# Altium schematic sheet 07_FPGA_C.SchDoc: FPGA Part C: Bank 5-6
size 381 x 266 mm; Organization: Meteroi; Address1: Room 428, 410 Guiping Rd.; Address2: Shanghai 200233, CHINA; SheetNumber: 8; SheetTotal: 11; PageSetup: Record=PageOptions|CenterHorizontal=True|CenterVertical=True|PrintScale=0.75|XCorrection=1.00|YCorrection=1.00|PrintKind=2|BorderSize=5000000|LeftOffset=0|BottomOffset=0|Orientation=2|PaperLength=1000|PaperWidth=1000|Scale=100|PaperSource=276|PrintQuality=-3|MediaType=1|DitherType=10|PaperKind=A4|PrintScaleMode=1
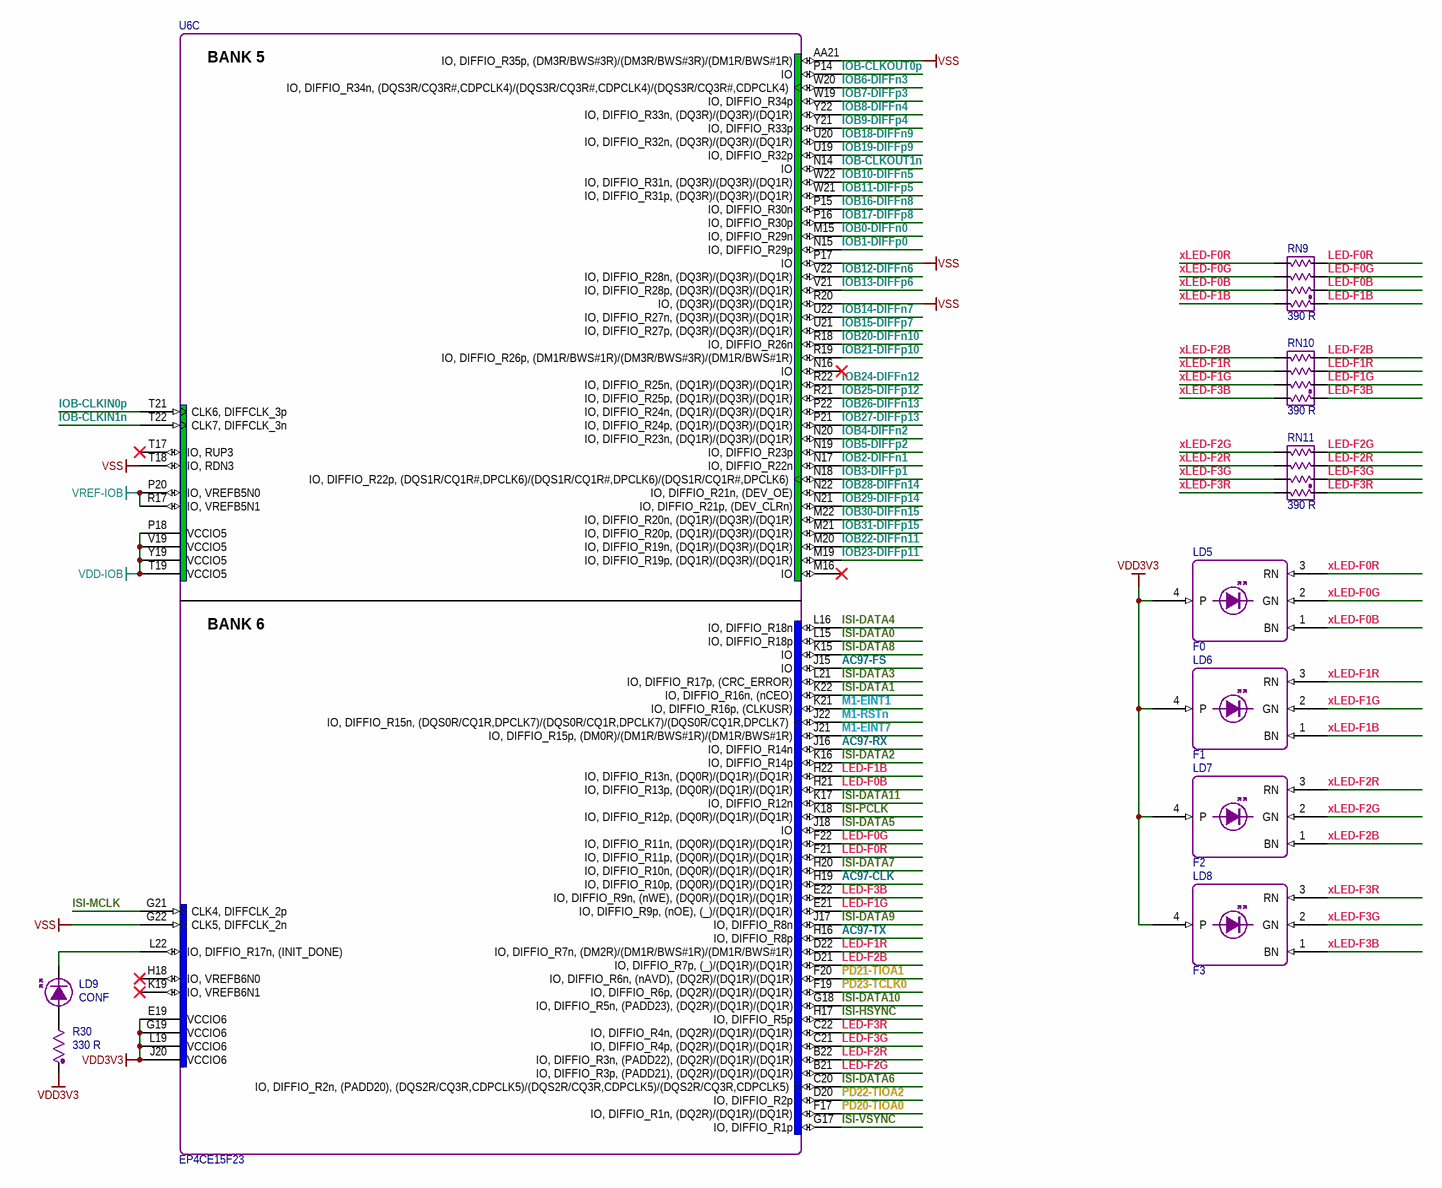
[diagram p0: 07_FPGA_C.SchDoc]

## Parts
LD5  F0  [LED_4B_S_S197]
LD6  F1  [LED_4B_S_S197]
LD7  F2  [LED_4B_S_S197]
LD8  F3  [LED_4B_S_S197]
LD9  CONF  [0603LD]
R30  330 R  [0402A2]
RN9  390 R  [0402PR4]
RN10  390 R  [0402PR4]
RN11  390 R  [0402PR4]
U6  EP4CE15F23  [FBGA-484]  (part C of 5)

## Nets
VDD3V3: LD5.4(P) LD6.4(P) LD7.4(P) LD8.4(P) R30.2 U6.E19(VCCIO6) U6.G19(VCCIO6) U6.J20(VCCIO6) U6.L19(VCCIO6)
VDD-IOB: U6.P18(VCCIO5) U6.T19(VCCIO5) U6.V19(VCCIO5) U6.Y19(VCCIO5)
VREF-IOB: U6.P20(IO,_VREFB5N0) U6.R17(IO,_VREFB5N1)
VSS: U6.AA21(IO,_DIFFIO_R35p,_(DM3R/BWS#3R)/(DM3R/BWS#3R)/(DM1R/BWS#1R)) U6.G22(CLK5,_DIFFCLK_2n) U6.P17(IO) U6.R20(IO,_(DQ3R)/(DQ3R)/(DQ1R)) U6.T18(IO,_RDN3)
AC97-CLK: U6.H19(IO,_DIFFIO_R10p,_(DQ0R)/(DQ1R)/(DQ1R))
AC97-FS: U6.J15(IO)
AC97-RX: U6.J16(IO,_DIFFIO_R14n)
AC97-TX: U6.H16(IO,_DIFFIO_R8p)
IOB0-DIFFn0: U6.M15(IO,_DIFFIO_R29n)
IOB1-DIFFp0: U6.N15(IO,_DIFFIO_R29p)
IOB2-DIFFn1: U6.N17(IO,_DIFFIO_R22n)
IOB3-DIFFp1: U6.N18(IO,_DIFFIO_R22p,_(DQS1R/CQ1R#,DPCLK6)/(DQS1R/CQ1R#,DPCLK6)/(DQS1R/CQ1R#,DPCLK6))
IOB4-DIFFn2: U6.N20(IO,_DIFFIO_R23n,_(DQ1R)/(DQ3R)/(DQ1R))
IOB5-DIFFp2: U6.N19(IO,_DIFFIO_R23p)
IOB6-DIFFn3: U6.W20(IO,_DIFFIO_R34n,_(DQS3R/CQ3R#,CDPCLK4)/(DQS3R/CQ3R#,CDPCLK4)/(DQS3R/CQ3R#,CDPCLK4))
IOB7-DIFFp3: U6.W19(IO,_DIFFIO_R34p)
IOB8-DIFFn4: U6.Y22(IO,_DIFFIO_R33n,_(DQ3R)/(DQ3R)/(DQ1R))
IOB9-DIFFp4: U6.Y21(IO,_DIFFIO_R33p)
IOB10-DIFFn5: U6.W22(IO,_DIFFIO_R31n,_(DQ3R)/(DQ3R)/(DQ1R))
IOB11-DIFFp5: U6.W21(IO,_DIFFIO_R31p,_(DQ3R)/(DQ3R)/(DQ1R))
IOB12-DIFFn6: U6.V22(IO,_DIFFIO_R28n,_(DQ3R)/(DQ3R)/(DQ1R))
IOB13-DIFFp6: U6.V21(IO,_DIFFIO_R28p,_(DQ3R)/(DQ3R)/(DQ1R))
IOB14-DIFFn7: U6.U22(IO,_DIFFIO_R27n,_(DQ3R)/(DQ3R)/(DQ1R))
IOB15-DIFFp7: U6.U21(IO,_DIFFIO_R27p,_(DQ3R)/(DQ3R)/(DQ1R))
IOB16-DIFFn8: U6.P15(IO,_DIFFIO_R30n)
IOB17-DIFFp8: U6.P16(IO,_DIFFIO_R30p)
IOB18-DIFFn9: U6.U20(IO,_DIFFIO_R32n,_(DQ3R)/(DQ3R)/(DQ1R))
IOB19-DIFFp9: U6.U19(IO,_DIFFIO_R32p)
IOB20-DIFFn10: U6.R18(IO,_DIFFIO_R26n)
IOB21-DIFFp10: U6.R19(IO,_DIFFIO_R26p,_(DM1R/BWS#1R)/(DM3R/BWS#3R)/(DM1R/BWS#1R))
IOB22-DIFFn11: U6.M20(IO,_DIFFIO_R19n,_(DQ1R)/(DQ3R)/(DQ1R))
IOB23-DIFFp11: U6.M19(IO,_DIFFIO_R19p,_(DQ1R)/(DQ3R)/(DQ1R))
IOB24-DIFFn12: U6.R22(IO,_DIFFIO_R25n,_(DQ1R)/(DQ3R)/(DQ1R))
IOB25-DIFFp12: U6.R21(IO,_DIFFIO_R25p,_(DQ1R)/(DQ3R)/(DQ1R))
IOB26-DIFFn13: U6.P22(IO,_DIFFIO_R24n,_(DQ1R)/(DQ3R)/(DQ1R))
IOB27-DIFFp13: U6.P21(IO,_DIFFIO_R24p,_(DQ1R)/(DQ3R)/(DQ1R))
IOB28-DIFFn14: U6.N22(IO,_DIFFIO_R21n,_(DEV_OE))
IOB29-DIFFp14: U6.N21(IO,_DIFFIO_R21p,_(DEV_CLRn))
IOB30-DIFFn15: U6.M22(IO,_DIFFIO_R20n,_(DQ1R)/(DQ3R)/(DQ1R))
IOB31-DIFFp15: U6.M21(IO,_DIFFIO_R20p,_(DQ1R)/(DQ3R)/(DQ1R))
IOB-CLKIN0p: U6.T21(CLK6,_DIFFCLK_3p)
IOB-CLKIN1n: U6.T22(CLK7,_DIFFCLK_3n)
IOB-CLKOUT0p: U6.P14(IO)
IOB-CLKOUT1n: U6.N14(IO)
ISI-DATA0: U6.L15(IO,_DIFFIO_R18p)
ISI-DATA1: U6.K22(IO,_DIFFIO_R16n,_(nCEO))
ISI-DATA2: U6.K16(IO,_DIFFIO_R14p)
ISI-DATA3: U6.L21(IO,_DIFFIO_R17p,_(CRC_ERROR))
ISI-DATA4: U6.L16(IO,_DIFFIO_R18n)
ISI-DATA5: U6.J18(IO)
ISI-DATA6: U6.C20(IO,_DIFFIO_R2n,_(PADD20),_(DQS2R/CQ3R,CDPCLK5)/(DQS2R/CQ3R,CDPCLK5)/(DQS2R/CQ3R,CDPCLK5))
ISI-DATA7: U6.H20(IO,_DIFFIO_R10n,_(DQ0R)/(DQ1R)/(DQ1R))
ISI-DATA8: U6.K15(IO)
ISI-DATA9: U6.J17(IO,_DIFFIO_R8n)
ISI-DATA10: U6.G18(IO,_DIFFIO_R5n,_(PADD23),_(DQ2R)/(DQ1R)/(DQ1R))
ISI-DATA11: U6.K17(IO,_DIFFIO_R12n)
ISI-HSYNC: U6.H17(IO,_DIFFIO_R5p)
ISI-MCLK: U6.G21(CLK4,_DIFFCLK_2p)
ISI-PCLK: U6.K18(IO,_DIFFIO_R12p,_(DQ0R)/(DQ1R)/(DQ1R))
ISI-VSYNC: U6.G17(IO,_DIFFIO_R1p)
LED-F0B: RN9.3 U6.H21(IO,_DIFFIO_R13p,_(DQ0R)/(DQ1R)/(DQ1R))
LED-F0G: RN9.5 U6.F22(IO,_DIFFIO_R11n,_(DQ0R)/(DQ1R)/(DQ1R))
LED-F0R: RN9.7 U6.F21(IO,_DIFFIO_R11p,_(DQ0R)/(DQ1R)/(DQ1R))
LED-F1B: RN9.1 U6.H22(IO,_DIFFIO_R13n,_(DQ0R)/(DQ1R)/(DQ1R))
LED-F1G: RN10.3 U6.E21(IO,_DIFFIO_R9p,_(nOE),_(_)/(DQ1R)/(DQ1R))
LED-F1R: RN10.5 U6.D22(IO,_DIFFIO_R7n,_(DM2R)/(DM1R/BWS#1R)/(DM1R/BWS#1R))
LED-F2B: RN10.7 U6.D21(IO,_DIFFIO_R7p,_(_)/(DQ1R)/(DQ1R))
LED-F2G: RN11.7 U6.B21(IO,_DIFFIO_R3p,_(PADD21),_(DQ2R)/(DQ1R)/(DQ1R))
LED-F2R: RN11.5 U6.B22(IO,_DIFFIO_R3n,_(PADD22),_(DQ2R)/(DQ1R)/(DQ1R))
LED-F3B: RN10.1 U6.E22(IO,_DIFFIO_R9n,_(nWE),_(DQ0R)/(DQ1R)/(DQ1R))
LED-F3G: RN11.3 U6.C21(IO,_DIFFIO_R4p,_(DQ2R)/(DQ1R)/(DQ1R))
LED-F3R: RN11.1 U6.C22(IO,_DIFFIO_R4n,_(DQ2R)/(DQ1R)/(DQ1R))
M1-EINT1: U6.K21(IO,_DIFFIO_R16p,_(CLKUSR))
M1-EINT7: U6.J21(IO,_DIFFIO_R15p,_(DM0R)/(DM1R/BWS#1R)/(DM1R/BWS#1R))
M1-RSTn: U6.J22(IO,_DIFFIO_R15n,_(DQS0R/CQ1R,DPCLK7)/(DQS0R/CQ1R,DPCLK7)/(DQS0R/CQ1R,DPCLK7))
PD20-TIOA0: U6.F17(IO,_DIFFIO_R1n,_(DQ2R)/(DQ1R)/(DQ1R))
PD21-TIOA1: U6.F20(IO,_DIFFIO_R6n,_(nAVD),_(DQ2R)/(DQ1R)/(DQ1R))
PD22-TIOA2: U6.D20(IO,_DIFFIO_R2p)
PD23-TCLK0: U6.F19(IO,_DIFFIO_R6p,_(DQ2R)/(DQ1R)/(DQ1R))
xLED-F0B: LD5.1(BN) RN9.4
xLED-F0G: LD5.2(GN) RN9.6
xLED-F0R: LD5.3(RN) RN9.8
xLED-F1B: LD6.1(BN) RN9.2
xLED-F1G: LD6.2(GN) RN10.4
xLED-F1R: LD6.3(RN) RN10.6
xLED-F2B: LD7.1(BN) RN10.8
xLED-F2G: LD7.2(GN) RN11.8
xLED-F2R: LD7.3(RN) RN11.6
xLED-F3B: LD8.1(BN) RN10.2
xLED-F3G: LD8.2(GN) RN11.4
xLED-F3R: LD8.3(RN) RN11.2
NetLD9_1: LD9.1 U6.L22(IO,_DIFFIO_R17n,_(INIT_DONE))
NetLD9_2: LD9.2 R30.1

Not connected (* = marked no-connect by the designer): U6 H18(IO,_VREFB6N0)* K19(IO,_VREFB6N1)* M16(IO)* N16(IO)* T17(IO,_RUP3)*

## Notes on the sheet
- Title:
- Project:
- Sheet:
- Of
- Size:
- D/N:
- Rev:
- Date:
- P/N:
- S/N:
- Designer:
- C
- (in symbol EP4CE15F23, part C) BANK 5; BANK 6

## Library data of the parts
LD5-LD8 = LED_3B: LED Pack 3; PartNumber: LL-S197BRGBC; Value: RGB; Vendor: Luckylight; Designer: shyul; SerialNumber: 0; PinCountSMD: 4; Status: S0; Version: 1.0; VersionDate: 04-27-2011; Publisher: Cowin; PCBMarker: LED; PinCountHole: 0
LD9 = LED: LED Single; PartNumber: 0; Value: Red; Designer: shyul; Vendor: Luckylight; PinCountSMD: 2; Status: S0; Version: 1.0; Publisher: Cowin; SerialNumber: 0; VersionDate: 04-27-2011; PCBMarker: LED; PinCountHole: 0
R30 = RES: Normal Resistor; PartNumber: 0; Vendor: KOA; Designer: shyul; PinCountSMD: 2; SerialNumber: 0; Value: 330 R; Version: 1.0; VersionDate: 04-27-2011; PCBMarker: Resistor; Publisher: Cowin; PinCountHole: 0
RN9-RN11 = RES_N4: Resistor Array x4; PartNumber: YC124-JR-07390RL; SerialNumber: 0; Vendor: YAGEO; Designer: shyul; PinCountSMD: 8; Value: 390 R; Version: 1.0; VersionDate: 04-27-2011; Publisher: Cowin; PCBMarker: Resistor Array; PinCountHole: 0
U6 = EP4CE15F23: Cyclone IV EP4CE15F23 FPGA; PartNumber: EP4CE15F23C8N; SerialNumber: 0; Vendor: Altera; Designer: shyul; PCBMarker: FPGA; Version: 1.0; VersionDate: 2-17-2012; Value: EP4CE15F23; Publisher: Cowin